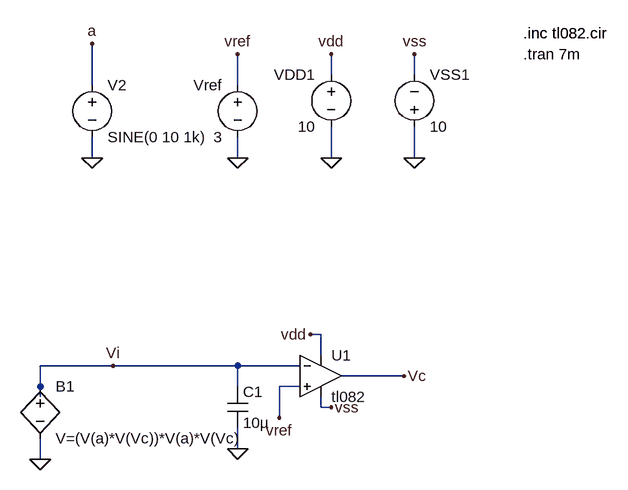
[diagram p0: schematic 8_1_1.asc]
8_1_1.asc, the LTspice schematic file:
Version 4
SHEET 1 880 680
WIRE 96 -48 96 -80
WIRE 224 -48 224 -80
WIRE -272 -32 -272 -96
WIRE -48 -32 -48 -80
WIRE -272 80 -272 48
WIRE -48 80 -48 48
WIRE 96 80 96 32
WIRE 224 80 224 32
WIRE 80 352 64 352
WIRE 80 384 80 352
WIRE -240 400 -352 400
WIRE -48 400 -240 400
WIRE 48 400 -48 400
WIRE 208 416 112 416
WIRE -352 432 -352 400
WIRE -48 432 -48 400
WIRE 48 432 16 432
WIRE -352 448 -352 432
WIRE 80 464 80 448
WIRE 96 464 80 464
WIRE 16 480 16 432
WIRE -48 528 -48 496
WIRE -352 544 -352 512
FLAG 96 80 0
FLAG 224 80 0
FLAG 96 -80 vdd
FLAG 224 -80 vss
FLAG 64 352 vdd
FLAG 96 464 vss
FLAG -48 80 0
FLAG -48 -80 vref
FLAG 16 480 vref
FLAG 208 416 Vc
FLAG -240 400 Vi
FLAG -352 544 0
FLAG -48 528 0
FLAG -272 80 0
FLAG -272 -96 a
SYMBOL voltage 96 -64 M0
SYMATTR InstName VDD1
SYMATTR Value 10
SYMBOL voltage 224 48 M180
WINDOW 0 24 96 Left 2
WINDOW 3 24 16 Left 2
SYMATTR InstName VSS1
SYMATTR Value 10
SYMBOL Opamps\\opamp2 80 352 R0
SYMATTR InstName U1
SYMATTR Value tl082
SYMBOL voltage -48 -48 M0
WINDOW 123 0 0 Left 2
WINDOW 39 0 0 Left 2
SYMATTR InstName Vref
SYMATTR Value 3
SYMBOL cap -64 432 R0
SYMATTR InstName C1
SYMATTR Value 10µ
SYMBOL voltage -272 -48 R0
WINDOW 123 0 0 Left 2
WINDOW 39 0 0 Left 2
SYMATTR InstName V2
SYMATTR Value SINE(0 10 1k)
SYMBOL bv -352 416 R0
SYMATTR InstName B1
SYMATTR Value V=(V(a)*V(Vc))*V(a)*V(Vc)
TEXT 392 -112 Left 2 !.inc tl082.cir
TEXT 392 -80 Left 2 !.tran 7m
TEXT 392 -112 Left 2 !.inc tl082.cir

The netlist it stands for:
* 8_1_1.asc
VDD1 vdd 0 10
VSS1 0 vss 10
XU1 vref Vi vdd vss Vc tl082  ; pins In+ In- V+ V- OUT
Vref vref 0 3
C1 Vi 0 10µ
V2 a 0 SINE(0 10 1k)
B1 Vi 0 V=(V(a)*V(Vc))*V(a)*V(Vc)
.inc tl082.cir
.tran 7m
.inc tl082.cir
.backanno
.end